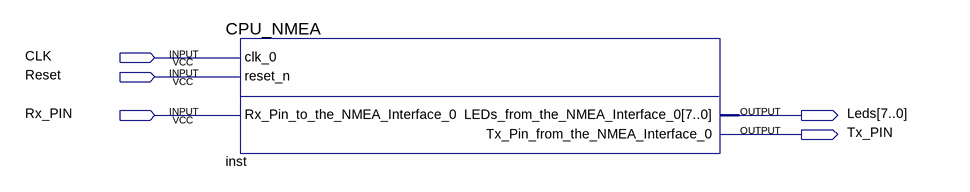
[diagram p0: schematic sheet]
// Quartus schematic Top.bdf as structural Verilog: 1 symbols, 5 pins
module Top (
  input  CLK,
  input  Reset,
  input  Rx_PIN,
  output [7:0] Leds,
  output Tx_PIN
);

  CPU_NMEA inst (
    .clk_0(CLK), .reset_n(Reset), .Rx_Pin_to_the_NMEA_Interface_0(Rx_PIN),
    .LEDs_from_the_NMEA_Interface_0(Leds), .Tx_Pin_from_the_NMEA_Interface_0(Tx_PIN));
endmodule
